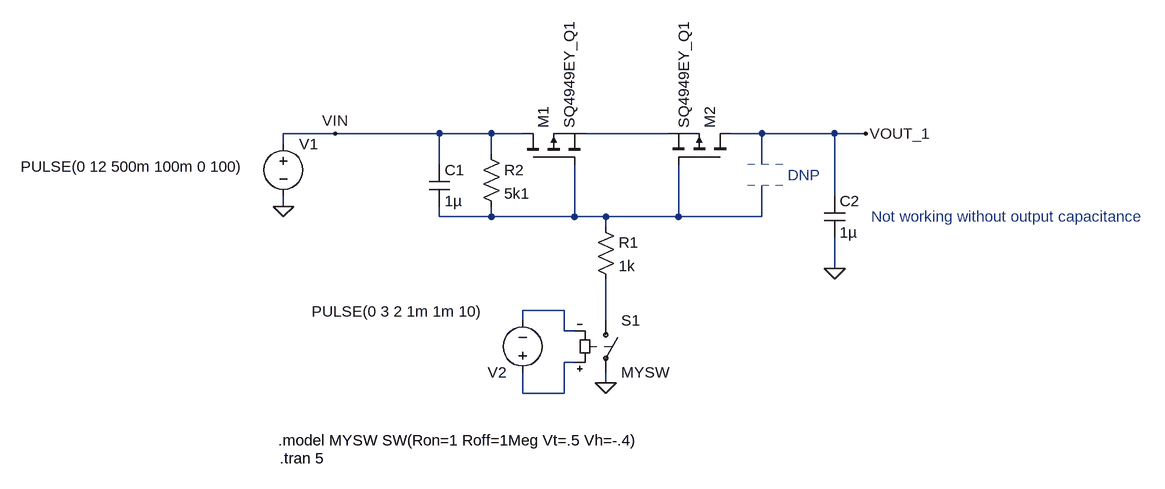
[diagram p0: schematic PMOS.asc]
PMOS.asc, the LTspice schematic file:
Version 4
SHEET 1 1040 1384
WIRE -256 96 -336 96
WIRE -96 96 -256 96
WIRE -16 96 -96 96
WIRE 32 96 -16 96
WIRE 256 96 128 96
WIRE 400 96 352 96
WIRE 512 96 400 96
WIRE 560 96 512 96
WIRE -336 112 -336 96
WIRE -16 128 -16 96
WIRE -96 144 -96 96
WIRE 400 144 400 96
WIRE 512 192 512 96
WIRE -336 208 -336 192
WIRE -96 224 -96 208
WIRE -16 224 -16 208
WIRE -16 224 -96 224
WIRE 112 224 112 144
WIRE 112 224 -16 224
WIRE 160 224 112 224
WIRE 272 224 272 144
WIRE 272 224 160 224
WIRE 400 224 400 176
WIRE 400 224 272 224
WIRE 160 240 160 224
WIRE 512 304 512 256
WIRE 96 368 32 368
WIRE 32 384 32 368
WIRE 160 384 160 320
WIRE 96 400 96 368
WIRE 112 400 96 400
WIRE 112 448 96 448
WIRE 160 480 160 464
WIRE 32 496 32 464
WIRE 96 496 96 448
WIRE 96 496 32 496
FLAG -336 208 0
FLAG 560 96 VOUT_1
FLAG 512 304 0
FLAG 160 480 0
FLAG -256 96 VIN
SYMBOL pmos 32 144 R270
SYMATTR InstName M1
SYMATTR Value SQ4949EY_Q1
SYMBOL voltage -336 96 R0
WINDOW 123 0 0 Left 0
WINDOW 39 0 0 Left 0
WINDOW 3 -404 51 Left 2
SYMATTR Value PULSE(0 12 500m 100m 0 100)
SYMATTR InstName V1
SYMBOL res 144 224 R0
SYMATTR InstName R1
SYMATTR Value 1k
SYMBOL res -32 112 R0
SYMATTR InstName R2
SYMATTR Value 5k1
SYMBOL pmos 352 144 M270
SYMATTR InstName M2
SYMATTR Value SQ4949EY_Q1
SYMBOL sw 160 368 R0
SYMATTR InstName S1
SYMATTR Value MYSW
SYMBOL cap -112 144 R0
SYMATTR InstName C1
SYMATTR Value 1µ
SYMBOL voltage 32 480 R180
WINDOW 3 61 110 Left 2
WINDOW 123 0 0 Left 0
WINDOW 39 0 0 Left 0
SYMATTR Value PULSE(0 3 2 1m 1m 10)
SYMATTR InstName V2
SYMBOL cap 496 192 R0
SYMATTR InstName C2
SYMATTR Value 1µ
TEXT 440 160 Left 2 ;DNP
TEXT 568 224 Left 2 ;Not working without output capacitance
TEXT -344 568 Left 2 !.model MYSW SW(Ron=1 Roff=1Meg Vt=.5 Vh=-.4)
TEXT -342 596 Left 2 !.tran 5
LINE Normal 432 144 368 144 2
LINE Normal 432 176 368 176 2

The netlist it stands for:
* PMOS.asc
M1 VIN N002 N001 N001 SQ4949EY_Q1
V1 VIN 0 PULSE(0 12 500m 100m 0 100)
R1 N002 N004 1k
R2 VIN N002 5k1
M2 VOUT_1 N002 N001 N001 SQ4949EY_Q1
S1 N004 0 N005 N003 MYSW
C1 VIN N002 1µ
V2 N005 N003 PULSE(0 3 2 1m 1m 10)
C2 VOUT_1 0 1µ
.model NMOS NMOS
.model PMOS PMOS
.lib standard.mos
* DNP
* Not working without output capacitance
.model MYSW SW(Ron=1 Roff=1Meg Vt=.5 Vh=-.4)
.tran 5
.backanno
.end

* Results of the author's LTspice run, read from the files saved beside the schematic
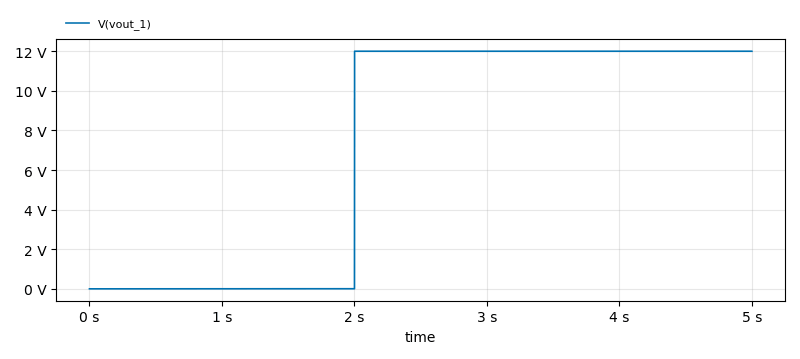
[diagram p1: Transient Analysis of PMOS.asc, plotted from the saved traces]
* Transient Analysis, 1 run:
*   V(vout_1): min 0 V, max 12 V, average 7.2 V, rms 9.295 V, last 12 V